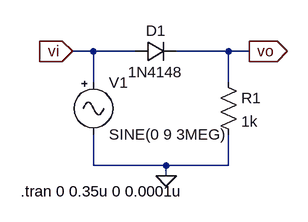
[diagram p0: schematic diodo2_conmutacion.asc]
diodo2_conmutacion.asc, the LTspice schematic file:
Version 4
SHEET 1 880 680
WIRE 80 64 48 64
WIRE 144 64 80 64
WIRE 288 64 208 64
WIRE 320 64 288 64
WIRE 80 112 80 64
WIRE 288 112 288 64
WIRE 80 240 80 192
WIRE 192 240 80 240
WIRE 288 240 288 192
WIRE 288 240 192 240
WIRE 192 256 192 240
FLAG 320 64 vo
IOPIN 320 64 Out
FLAG 48 64 vi
IOPIN 48 64 In
FLAG 192 256 0
SYMBOL Misc\\signal 80 96 R0
WINDOW 123 0 0 Left 2
WINDOW 39 0 0 Left 2
SYMATTR InstName V1
SYMATTR Value SINE(0 9 3MEG)
SYMBOL res 272 96 R0
SYMATTR InstName R1
SYMATTR Value 1k
SYMATTR SpiceLine pwr=0.5
SYMBOL diode 144 80 R270
WINDOW 0 32 32 VTop 2
WINDOW 3 0 32 VBottom 2
SYMATTR InstName D1
SYMATTR Value 1N4148
TEXT -32 280 Left 2 !.tran 0 0.35u 0 0.0001u

The netlist it stands for:
* diodo2_conmutacion.asc
V1 vi 0 SINE(0 9 3MEG)
R1 vo 0 1k pwr=0.5
D1 vi vo 1N4148
.model D D
.lib standard.dio
.tran 0 0.35u 0 0.0001u
.backanno
.end